# EAGLE design BlueNoise-pcb-board (EAGLE 9.6.2)
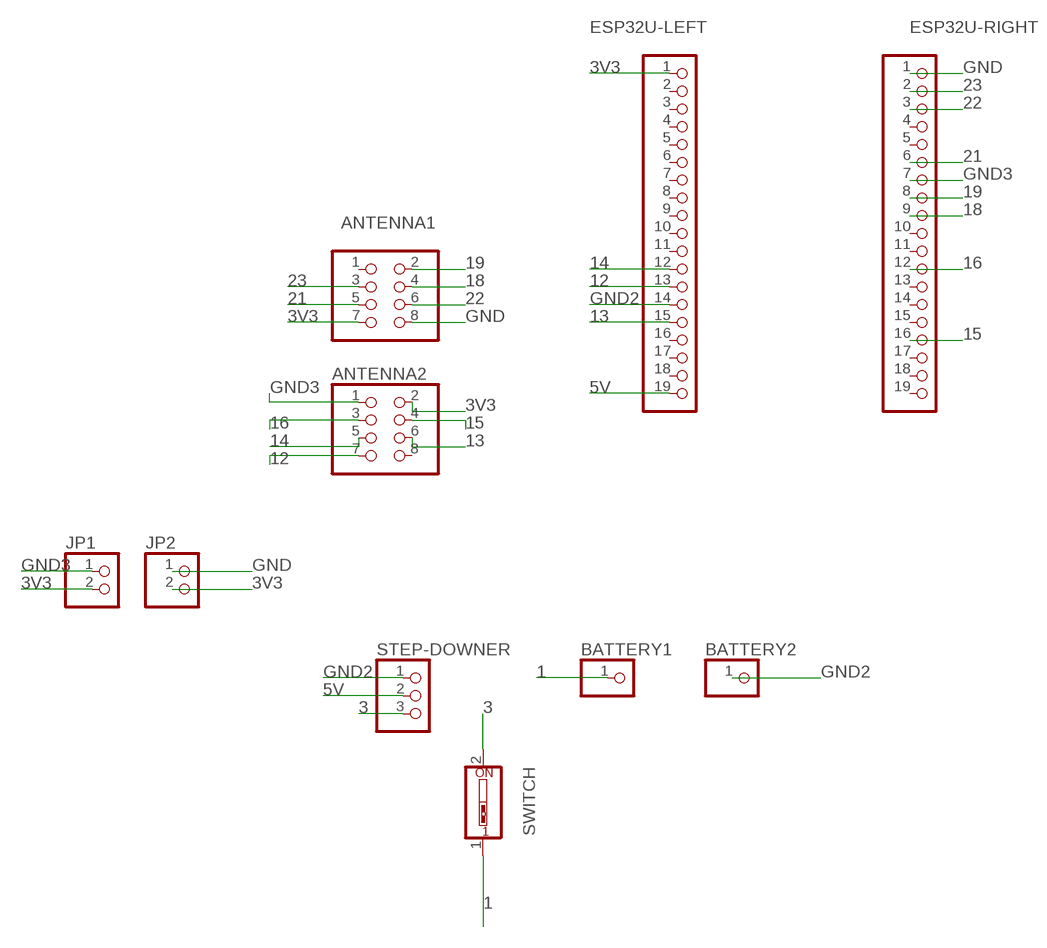
[diagram p0: schematic, sheet 1]

## Parts
ANTENNA1  PINHD-2X4  [2X04]
ANTENNA2  PINHD-2X4  [2X04]
BATTERY1  PINHD-1X1  [1X01]
BATTERY2  PINHD-1X1  [1X01]
ESP32U-LEFT  PINHD-1X19  [1X19]
ESP32U-RIGHT  PINHD-1X19  [1X19]
JP1  PINHD-1X2  [1X02]
JP2  PINHD-1X2  [1X02]
STEP-DOWNER  PINHD-1X3  [1X03]
SWITCH  SW_DIP-1  [EDG-01]

## Nets
1: BATTERY1.1 SWITCH.1
3: STEP-DOWNER.3 SWITCH.2
3V3: ANTENNA1.7 ANTENNA2.2 ESP32U-LEFT.1 JP1.2 JP2.2
5V: ESP32U-LEFT.19 STEP-DOWNER.2
12: ANTENNA2.7 ESP32U-LEFT.13
13: ANTENNA2.6 ESP32U-LEFT.15
14: ANTENNA2.5 ESP32U-LEFT.12
15: ANTENNA2.4 ESP32U-RIGHT.16
16: ANTENNA2.3 ESP32U-RIGHT.12
18: ANTENNA1.4 ESP32U-RIGHT.9
19: ANTENNA1.2 ESP32U-RIGHT.8
21: ANTENNA1.5 ESP32U-RIGHT.6
22: ANTENNA1.6 ESP32U-RIGHT.3
23: ANTENNA1.3 ESP32U-RIGHT.2
GND: ANTENNA1.8 ESP32U-RIGHT.1 JP2.1
GND2: BATTERY2.1 ESP32U-LEFT.14 STEP-DOWNER.1
GND3: ANTENNA2.1 ESP32U-RIGHT.7 JP1.1
Unconnected: ANTENNA1.1 ANTENNA2.8 ESP32U-LEFT.2 ESP32U-LEFT.3 ESP32U-LEFT.4 ESP32U-LEFT.5 ESP32U-LEFT.6 ESP32U-LEFT.7 ESP32U-LEFT.8 ESP32U-LEFT.9 ESP32U-LEFT.10 ESP32U-LEFT.11 ESP32U-LEFT.16 ESP32U-LEFT.17 ESP32U-LEFT.18 ESP32U-RIGHT.4 ESP32U-RIGHT.5 ESP32U-RIGHT.10 ESP32U-RIGHT.11 ESP32U-RIGHT.13 ESP32U-RIGHT.14 ESP32U-RIGHT.15 ESP32U-RIGHT.17 ESP32U-RIGHT.18 ESP32U-RIGHT.19

## Library data of the parts
ANTENNA1 ANTENNA2 = pinhead:PINHD-2X4: PIN HEADER
BATTERY1 BATTERY2 = pinhead:PINHD-1X1: PIN HEADER
ESP32U-LEFT ESP32U-RIGHT = pinhead:PINHD-1X19: PIN HEADER
JP1 JP2 = pinhead:PINHD-1X2: PIN HEADER
STEP-DOWNER = pinhead:PINHD-1X3: PIN HEADER
SWITCH = special:SW_DIP-1: DIP SWITCH

## Module NRF
Ports: 

### Library data of the parts

## Board
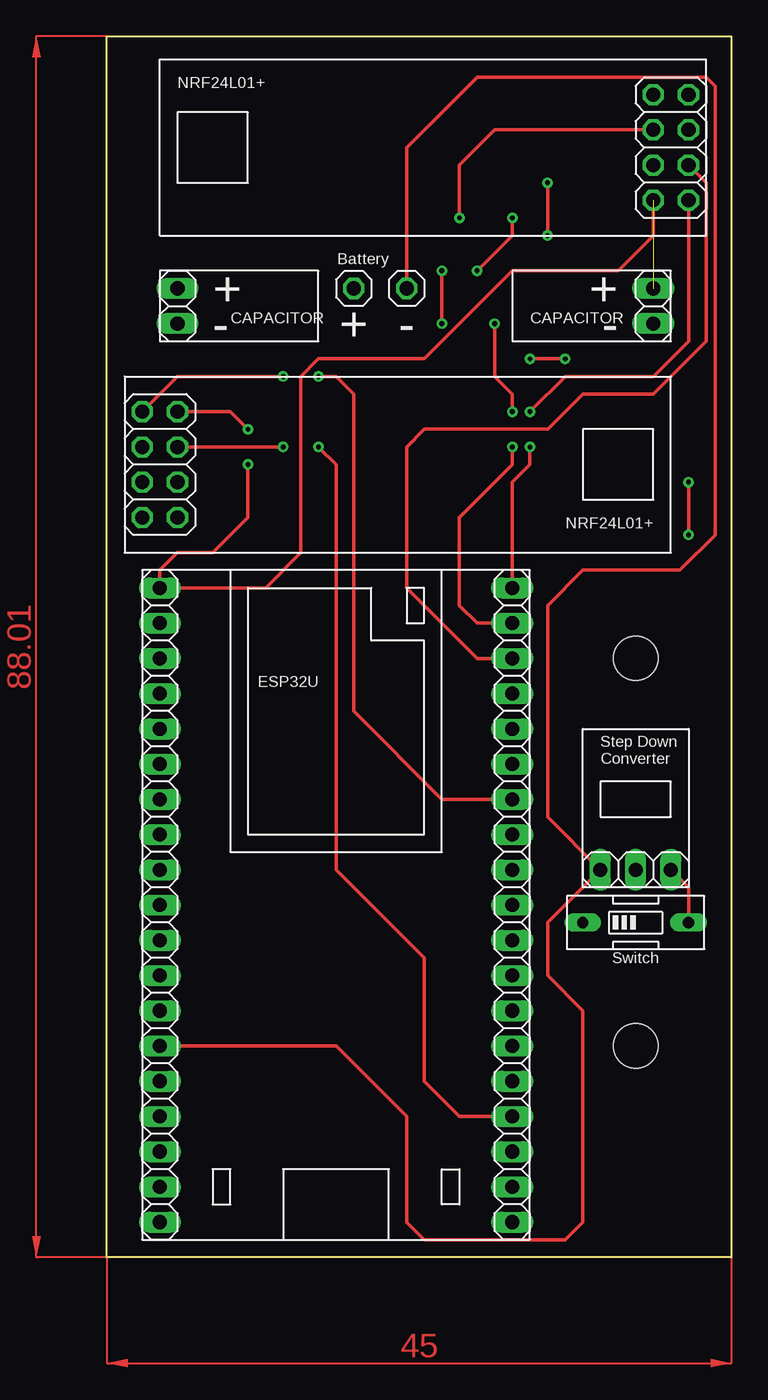
[diagram p1: board, top side]
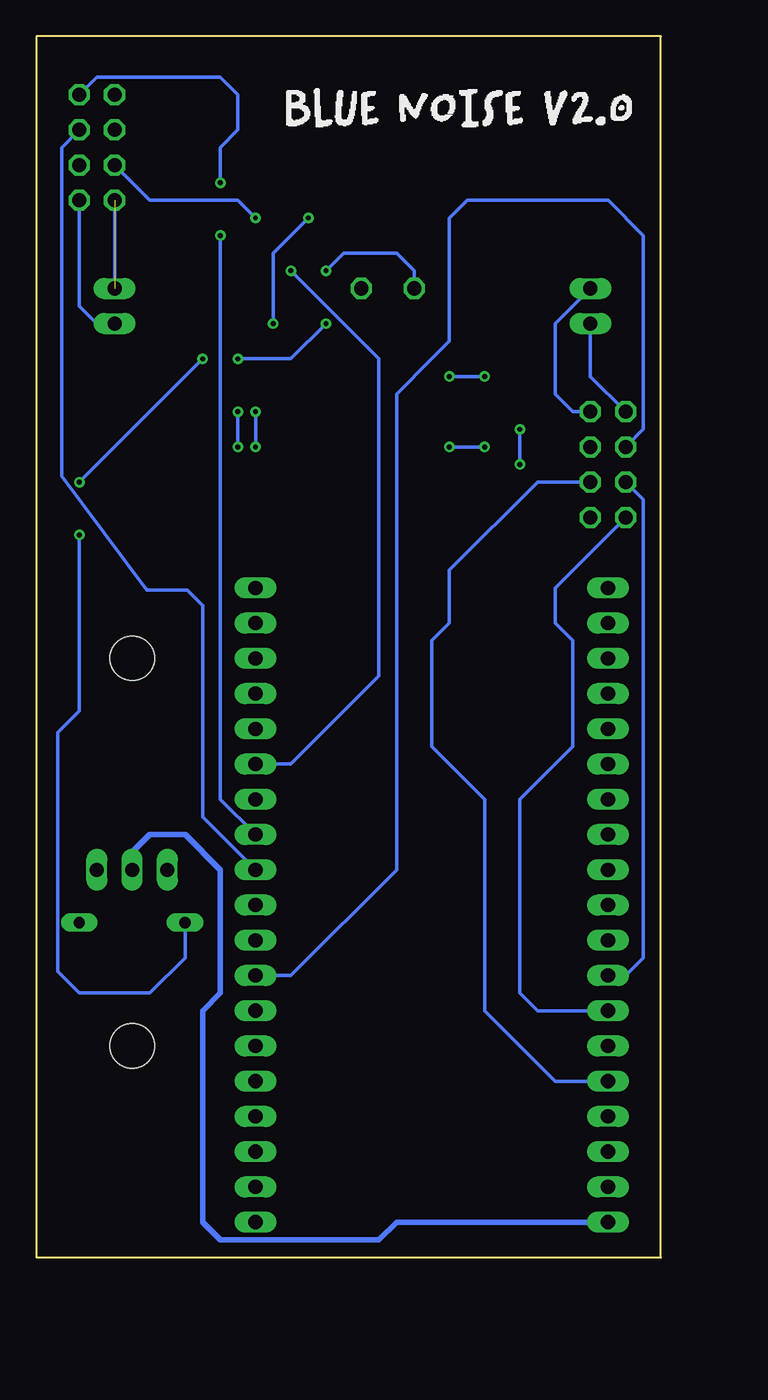
[diagram p2: board, bottom side, seen from below]

Size 45 x 88.01 mm. Coordinates in mm from the lower left corner, seen from the top.
Outline: 0,0 0,88.01 45,88.01 45,0 0,0
Copper layers (1*16): Top 0.035mm / dielectric 1.5mm / Bottom 0.035mm
Design rules "default": minimum track width 6mil, minimum drill 0.35mm, track to track 6mil, track to pad 6mil, pad to pad 6mil, via to via 6mil, smd to smd 6mil, copper to edge 40mil, drill to drill 6mil, minimum pad ring 10mil, minimum via ring 8mil, stop-mask expansion 4mil, vias tented up to drill 0mil, thermal gap 10mil

### Footprints (pad centres in the part's own frame; a part is rotated, then mirrored left to right if it is on the bottom)
2X04 = drill 1.016 octagon: 1 -3.81,-1.27; 2 -3.81,1.27; 3 -1.27,-1.27; 4 -1.27,1.27; 5 1.27,-1.27; 6 1.27,1.27; 7 3.81,-1.27; 8 3.81,1.27
1X01 = drill 1.016 octagon: 1 0,0
1X19 = drill 1.016 long: 1 -22.86,0; 2 -20.32,0; 3 -17.78,0; 4 -15.24,0; 5 -12.7,0; 6 -10.16,0; 7 -7.62,0; 8 -5.08,0; 9 -2.54,0; 10 0,0; 11 2.54,0; 12 5.08,0; 13 7.62,0; 14 10.16,0; 15 12.7,0; 16 15.24,0; 17 17.78,0; 18 20.32,0; 19 22.86,0
1X02 = drill 1.016 long: 1 -1.27,0; 2 1.27,0
1X03 = drill 1.016 long: 1 -2.54,0; 2 0,0; 3 2.54,0
EDG-01 = drill 0.813 long: 1 0,-3.81; 2 0,3.81
M3HOLE = hole 3.2: 0,0

### Placement (x,y rotation side)
ANTENNA1  40.64,80.01 270 top
ANTENNA2  3.81,57.15 270 top
BATTERY1  17.78,69.85 0 top
BATTERY2  21.59,69.85 0 top
ESP32U-LEFT  3.81,25.4 270 top
ESP32U-RIGHT  29.21,25.4 270 top
JP1  5.08,68.58 90 top
JP2  39.37,68.58 90 top
STEP-DOWNER  38.1,27.94 0 top
SWITCH  38.1,24.13 270 top
U$2  [M3HOLE]  38.1,15.24 0 top
U$3  [M3HOLE]  38.1,43.18 0 top

### Tracks (layer width: path | path; a pad name or v marks a point on that pad's centre or on a via)
1  (via drill 0.35)
  Top 0.254: v30.48,64.77 v33.02,64.77 | v41.91,55.88 v41.91,52.07 | v24.13,67.31 v24.13,71.12
  Bottom 0.254: v24.13,67.31 26.67,64.77 v30.48,64.77 | v33.02,64.77 v41.91,55.88 | v41.91,52.07 41.91,39.37 43.46,37.82 43.46,20.6 41.91,19.05 36.83,19.05 34.29,21.59 SWITCH.1 | v24.13,71.12 22.86,72.39 19.05,72.39 17.78,71.12 BATTERY1.1
3
  Top 0.254: STEP-DOWNER.3 41.91,26.67 SWITCH.2
3V3  (via drill 0.35)  (1 unrouted)
  Top 0.254: ANTENNA1.7 39.37,73.66 36.83,71.12 29.21,71.12 22.86,64.77 15.24,64.77 13.97,63.5 13.97,50.8 11.43,48.26 ESP32U-LEFT.1 3.81,49.53 5.08,50.8 7.62,50.8 10.16,53.34 v10.16,57.15 | v10.16,59.69 8.89,60.96 ANTENNA2.2
  Bottom 0.254: v10.16,59.69 v10.16,57.15 | ANTENNA2.2 6.35,60.96 7.62,62.23 7.62,67.31 JP1.2 | JP2.2 ANTENNA1.7
5V
  Bottom 0.381: ESP32U-LEFT.19 19.05,2.54 20.32,1.27 22.86,1.27 31.75,1.27 33.02,2.54 33.02,17.78 31.75,19.05 31.75,20.32 31.75,27.94 34.29,30.48 36.83,30.48 38.1,29.21 STEP-DOWNER.2
12
  Bottom 0.254: ESP32U-LEFT.13 8.89,17.78 10.16,19.05 10.16,33.02 6.35,36.83 6.35,44.45 7.62,45.72 7.62,48.26 ANTENNA2.7
13
  Bottom 0.254: ANTENNA2.6 8.89,55.88 15.24,49.53 15.24,45.72 16.51,44.45 16.51,36.83 12.7,33.02 12.7,17.78 7.62,12.7 ESP32U-LEFT.15
14
  Bottom 0.254: ANTENNA2.5 1.27,54.61 1.27,21.59 2.54,20.32 ESP32U-LEFT.12
15  (via drill 0.35)
  Top 0.254: ESP32U-RIGHT.16 25.4,10.16 22.86,12.7 22.86,21.59 16.51,27.94 16.51,57.15 v15.24,58.42 | ANTENNA2.4 v12.7,58.42
  Bottom 0.254: v12.7,58.42 v15.24,58.42
16
  Bottom 0.254: ANTENNA2.3 1.27,59.69 1.27,73.66 3.81,76.2 13.97,76.2 15.24,74.93 15.24,66.04 16.51,64.77 19.05,62.23 19.05,27.94 26.67,20.32 ESP32U-RIGHT.12
18
  Bottom 0.254: ESP32U-RIGHT.9 33.02,31.75 33.02,46.99 34.14,48.11 37.03,48.11 43.18,56.3 43.18,80.01 ANTENNA1.4
19  (via drill 0.35)
  Top 0.254: v31.75,77.47 v31.75,73.66
  Bottom 0.254: ANTENNA1.2 40.64,85.09 31.75,85.09 30.48,83.82 30.48,81.28 31.75,80.01 v31.75,77.47 | ESP32U-RIGHT.8 31.75,33.02 v31.75,73.66
21  (via drill 0.35)
  Top 0.254: v29.21,74.93 29.21,73.66 v26.67,71.12
  Bottom 0.254: ANTENNA1.5 36.83,76.2 30.48,76.2 v29.21,74.93 | ESP32U-RIGHT.6 26.67,35.56 20.32,41.91 20.32,64.77 v26.67,71.12
22
  Top 0.254: ANTENNA1.6 43.18,77.47 43.18,66.04 39.37,62.23 34.29,62.23 31.75,59.69 22.86,59.69 21.59,58.42 21.59,48.26 26.67,43.18 ESP32U-RIGHT.3
23  (via drill 0.35)
  Top 0.254: ESP32U-RIGHT.2 26.67,45.72 25.4,46.99 25.4,53.34 29.21,57.15 v29.21,58.42 | v25.4,74.93 25.4,78.74 27.94,81.28 ANTENNA1.3 | v27.94,67.31 27.94,63.5 29.21,62.23 v29.21,60.96
  Bottom 0.254: v27.94,67.31 27.94,72.39 v25.4,74.93 | v29.21,58.42 v29.21,60.96
GND  (via drill 0.35)
  Top 0.254: ANTENNA1.8 41.91,66.04 39.37,63.5 33.02,63.5 v30.48,60.96 | 29.21,50.8 ESP32U-RIGHT.1 29.21,55.88 30.48,57.15 v30.48,58.42
  Bottom 0.254: JP2.1 40.64,67.31 41.91,68.58 ANTENNA1.8 | v30.48,58.42 v30.48,60.96
GND2
  Top 0.254: ESP32U-LEFT.14 16.51,15.24 21.59,10.16 21.59,2.54 22.86,1.27 33.02,1.27 34.29,2.54 34.29,17.78 31.75,20.32 31.75,24.13 STEP-DOWNER.1 31.75,31.75 31.75,46.99 34.29,49.53 41.29,49.53 43.83,52.07 43.83,84.44 43.18,85.09 26.67,85.09 21.59,80.01 BATTERY2.1
GND3  (via drill 0.35)
  Top 0.254: ANTENNA2.1 5.08,63.5 v12.7,63.5 | ESP32U-RIGHT.7 24.13,33.02 17.78,39.37 17.78,62.23 16.51,63.5 v15.24,63.5
  Bottom 0.254: JP1.1 5.08,63.5 ANTENNA2.1 | v12.7,63.5 v15.24,63.5
(copper drawn outside any net)
  shapes: Top area x2

### Text on the board
tPlace: NRF24L01+ | Battery | + | + | CAPACITOR | + | - | CAPACITOR | - | - | NRF24L01+ | ESP32U | Step Down / Converter | Switch